# EAGLE schematic Sensor_ESP32_1.0 (EAGLE 9.6.2)
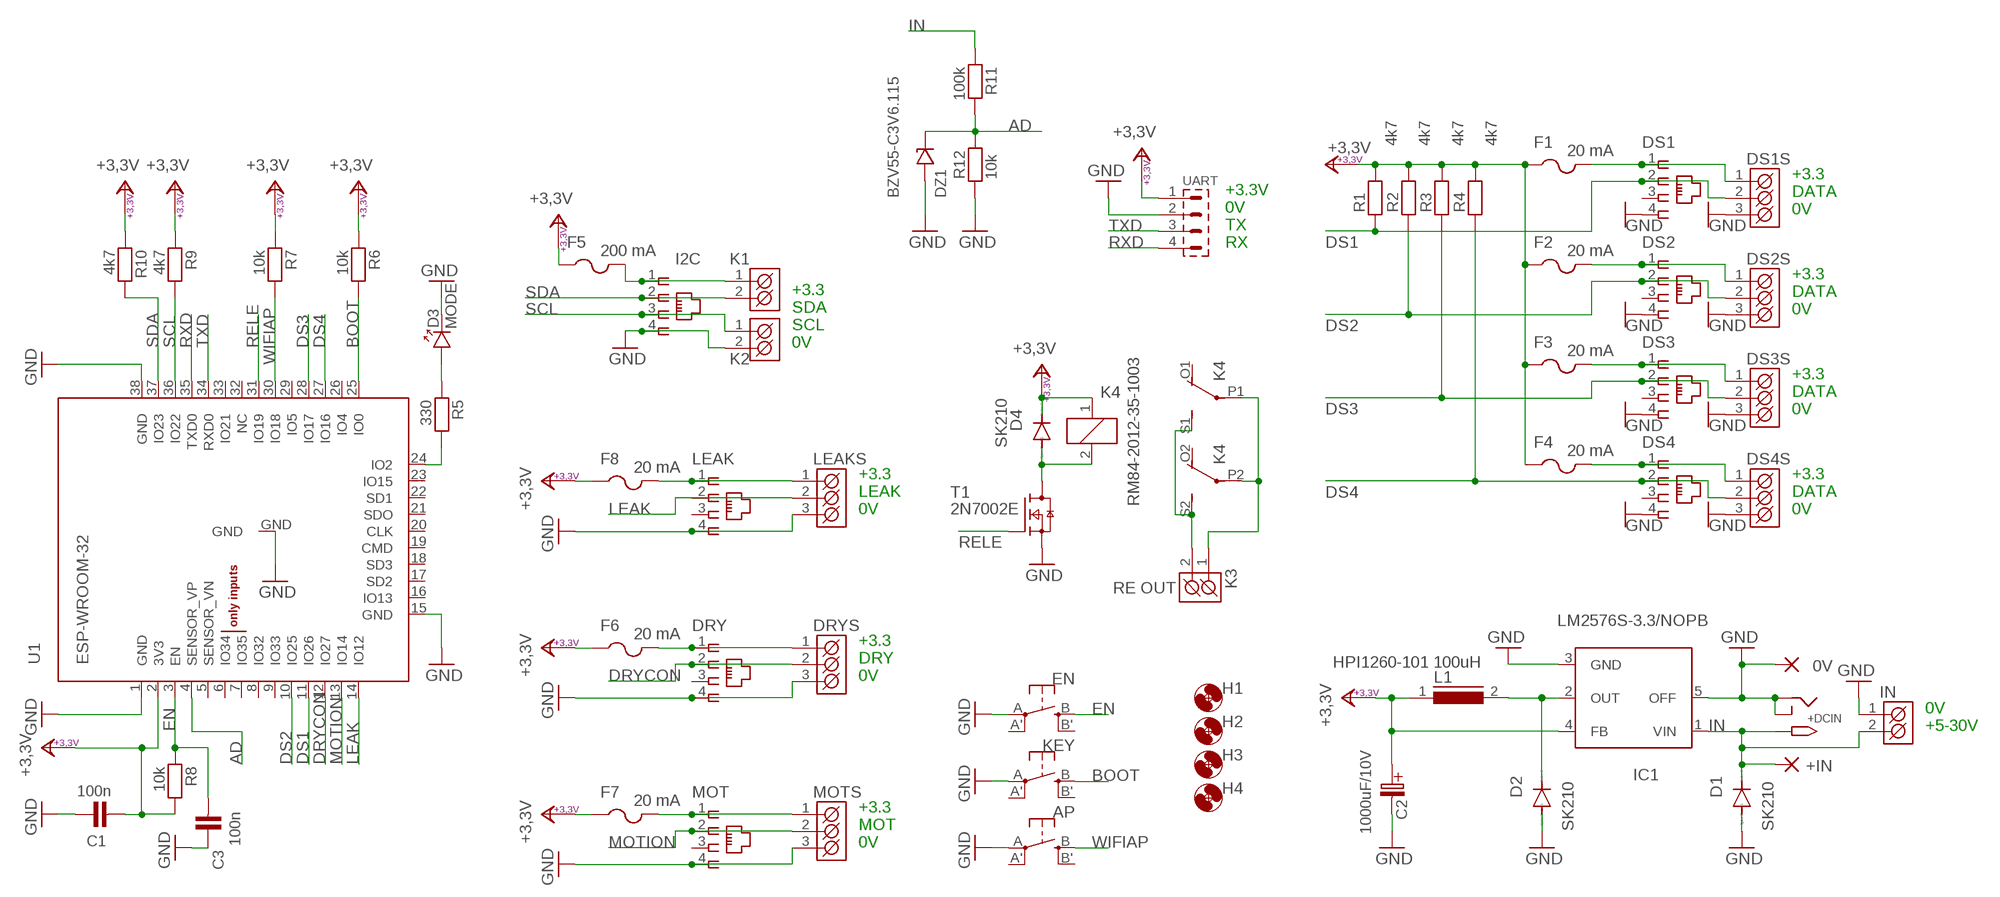
[diagram p0: schematic, sheet 1]

## Parts
0V  SMD2  [SMD1,27-2,54]
+DCIN  2.1MMJACKTHM  [PJ-102A]
+IN  SMD2  [SMD1,27-2,54]
AP  SPST_TACT-EVQQ2  [EVQ-Q2]
C1  100n  C-KER_1206  [1206]
C2  1000uF/10V  C-EL_5  [C-EL_5]
C3  100n  C-KER_1206  [1206]
D1  SK210  DIODE-SMB  [SMB]
D2  SK210  DIODE-SMB  [SMB]
D3  MODE  LED_1206  [P1206]
D4  SK210  DIODE-SMB  [SMB]
DRY  WEBP_6_1  [WEBP_6_1]
DRYS  ARK550/3  [ARK550/3]
DS1  WEBP_6_1  [WEBP_6_1]
DS1S  ARK550/3  [ARK550/3]
DS2  WEBP_6_1  [WEBP_6_1]
DS2S  ARK550/3  [ARK550/3]
DS3  WEBP_6_1  [WEBP_6_1]
DS3S  ARK550/3  [ARK550/3]
DS4  WEBP_6_1  [WEBP_6_1]
DS4S  ARK550/3  [ARK550/3]
DZ1  BZV55-C3V6.115  D-BZV55C_SMD_0,5W-ZENER  [SOD-80]
EN  SPST_TACT-EVQQ2  [EVQ-Q2]
F1  20 mA  PTCFUSE-1206  [R1206]
F2  20 mA  PTCFUSE-1206  [R1206]
F3  20 mA  PTCFUSE-1206  [R1206]
F4  20 mA  PTCFUSE-1206  [R1206]
F5  200 mA  PTCFUSE-1206  [R1206]
F6  20 mA  PTCFUSE-1206  [R1206]
F7  20 mA  PTCFUSE-1206  [R1206]
F8  20 mA  PTCFUSE-1206  [R1206]
H1  MOUNT-HOLE3.0  [3,0]
H2  MOUNT-HOLE3.0  [3,0]
H3  MOUNT-HOLE3.0  [3,0]
H4  MOUNT-HOLE3.0  [3,0]
I2C  WEBP_6_1  [WEBP_6_1]
IC1  LM2576S-3.3/NOPB  LM2576S  [TO263-5]
IN  ARK550/2  [ARK550/2]
K1  ARK550/2  [ARK550/2]
K2  ARK550/2  [ARK550/2]
K3  RE OUT  ARK500/2  [ARK500/2]
K4  RM84-2012-35-1003  G2R2  [G2R2]
KEY  SPST_TACT-EVQQ2  [EVQ-Q2]
L1  HPI1260-101 100uH  DR125  [DR125]
LEAK  WEBP_6_1  [WEBP_6_1]
LEAKS  ARK550/3  [ARK550/3]
MOT  WEBP_6_1  [WEBP_6_1]
MOTS  ARK550/3  [ARK550/3]
R1  4k7  R_1206  [1206]
R2  4k7  R_1206  [1206]
R3  4k7  R_1206  [1206]
R4  4k7  R_1206  [1206]
R5  330  R_1206  [1206]
R6  10k  R_1206  [1206]
R7  10k  R_1206  [1206]
R8  10k  R_1206  [1206]
R9  4k7  R_1206  [1206]
R10  4k7  R_1206  [1206]
R11  100k  R_1206  [1206]
R12  10k  R_1206  [1206]
T1  2N7002E  [SOT23]
U1  ESP-WROOM-32  [ESP-WROOM-32]
UART  S1G4_JUMP  [S1G4_JUM]

## Nets
+3,3V: C1.2 C2.C+(C_EL+) D4.C F1.1 F2.1 F3.1 F4.1 F5.1 F6.1 F7.1 F8.1 IC1.4(FB) K4.1 L1.1 R1.2 R2.2 R3.2 R4.2 R6.1 R7.1 R8.2 R9.1 R10.1 U1.2(3V3) UART.1
AD: DZ1.K R11.2 R12.2 U1.4(SENSOR_VP)
BOOT: KEY.B(S) R6.2 U1.25(IO0)
DRYCON: DRY.2 DRYS.2(K2) U1.12(IO27)
DS1: DS1.2 DS1S.2(K2) R1.1 U1.11(IO26)
DS2: DS2.2 DS2S.2(K2) R2.1 U1.10(IO25)
DS3: DS3.2 DS3S.2(K2) R3.1 U1.28(IO17)
DS4: DS4.2 DS4S.2(K2) R4.1 U1.27(IO16)
EN: C3.2 EN.B(S) R8.1 U1.3(EN)
GND: 0V.1(P) +DCIN.RING +DCIN.RING_SW AP.A(P) C1.1 C2.C-(C_EL-) C3.1 D1.A D2.A D3.K DRY.4 DRYS.3(K3) DS1.4 DS1S.3(K3) DS2.4 DS2S.3(K3) DS3.4 DS3S.3(K3) DS4.4 DS4S.3(K3) DZ1.A EN.A(P) I2C.4 IC1.3(GND) IC1.5(OFF) IN.1(K1) K2.2(K2) KEY.A(P) LEAK.4 LEAKS.3(K3) MOT.4 MOTS.3(K3) R12.1 T1.2(S) U1.1(GND) U1.15(GND) U1.38(GND) U1.GND UART.2
IN: +DCIN.TIP +IN.1(P) D1.C IC1.1(VIN) IN.2(K2) R11.1
LEAK: LEAK.2 LEAKS.2(K2) U1.14(IO12)
MOTION: MOT.2 MOTS.2(K2) U1.13(IO14)
N$1: DS1.1 DS1S.1(K1) F1.2
N$2: D2.C IC1.2(OUT) L1.2
N$3: DS2.1 DS2S.1(K1) F2.2
N$4: F8.2 LEAK.1 LEAKS.1(K1)
N$5: DS3.1 DS3S.1(K1) F3.2
N$6: DS4.1 DS4S.1(K1) F4.2
N$7: F5.2 I2C.1 K1.1(K1)
N$8: D4.A K4.2 T1.3(D)
N$9: R5.2 U1.24(IO2)
N$10: K3.2(K2) K4.S1(2:S) K4.S2(3:S)
N$11: K3.1(K1) K4.P1(2:P) K4.P2(3:P)
N$12: DRY.1 DRYS.1(K1) F6.2
N$13: F7.2 MOT.1 MOTS.1(K1)
N$18: D3.A R5.1
RELE: T1.1(G) U1.31(IO19)
RXD: U1.35(TXD0) UART.4
SCL: I2C.3 K2.1(K1) R9.2 U1.36(IO22)
SDA: I2C.2 K1.2(K2) R10.2 U1.37(IO23)
TXD: U1.34(RXD0) UART.3
WIFIAP: AP.B(S) R7.2 U1.30(IO18)
Unconnected: AP.A'(P1) AP.B'(S1) DRY.3 DS1.3 DS2.3 DS3.3 DS4.3 EN.A'(P1) EN.B'(S1) K4.O1(2:O) K4.O2(3:O) KEY.A'(P1) KEY.B'(S1) LEAK.3 MOT.3 U1.5(SENSOR_VN) U1.6(IO34) U1.7(IO35) U1.8(IO32) U1.9(IO33) U1.16(IO13) U1.17(SD2) U1.18(SD3) U1.19(CMD) U1.20(CLK) U1.21(SDO) U1.22(SD1) U1.23(IO15) U1.26(IO4) U1.29(IO5) U1.32(NC) U1.33(IO21)

## Notes on the sheet
- +3.3
  DATA
  0V
- +3.3V
  0V
  TX
  RX
- +3.3
  DATA
  0V
- +3.3
  SDA
  SCL
  0V
- +3.3
  DATA
  0V
- +3.3
  LEAK
  0V
- +3.3
  DATA
  0V
- +3.3
  DRY
  0V
- 0V
  +5-30V
- +3.3
  MOT
  0V

## Library data of the parts
0V +IN = wirepad:SMD2: SMD PAD
+DCIN = adafruit:2.1MMJACK: 2.1mm x 5.5mm THM DC jack with internal switch. Digikey part #PJ-102A, 4UCON part #05537 2.1mm x 5.5mm SMT DC jack with internal switch. Digikey part #PJ-002A-SMT, 4UCON part #03267 By microbuilder.eu & adafruit.com
AP EN KEY = adafruit:SPST_TACT: SMT 6mm switch, EVQQ2 series http://www.ladyada.net/library/eagle
C1 C3 = #PaJa_31:C-KER: Kondenzator - keramicky
C2 = #PaJa_31:C-EL: Kondenzator - elektrolyticky
D1 D2 D4 = diode:DIODE-: DIODE
D3 = #PaJa_31:LED: LED - jednobarevna
DRY DS1-DS4 I2C LEAK MOT = #PaJa_konektory:WEBP_6_1
DRYS DS1S DS2S DS3S DS4S LEAKS MOTS = #PaJa_konektory:ARK550/3: Svorkovnice - roztec 3,5mm - trojita
DZ1 = #PaJa_31:D-?-ZENER: Zenerova dioda
F1-F8 = adafruit:PTCFUSE: PTC fuses, resettable thermistors
H1-H4 = holes:MOUNT-HOLE: MOUNTING HOLE with drill center marker
IC1 = v-reg-3:LM2576: National Semiconductor <http://www.national.com> 3.0A "Simple Switcher"(c) 52kHz, Vout 1.23-37V (HV: 57V), Vin 40V (HV: 60V), 50µA standby current
IN K1 K2 = #PaJa_konektory:ARK550/2: Svorkovnice - roztec 3,5mm - dvojita
K3 = #PaJa_konektory:ARK500/2: Svorkovnice - roztec 5mm - dvojita
K4 = relay:G2R2: RELAY 2 x switch, Omron; MF: OMRON COMPONENTS USA; MPN: G2R-2-DC6; OC_FARNELL: unknown; OC_NEWARK: 89C5317
L1 = inductors:DR125: High Power Density, High Efficiency, Shielded Inductors Source: coiltronics_dr_series.pdf; SPICEPREFIX: L
R1-R12 = #PaJa_31:R: Rezistor
T1 = nxp_60:2N7002: N-channel TrenchMOS FET N-channel enhancement mode Field-Effect Transistor (FET) in a plastic package using TrenchMOS technology. AAL Eindhoven MK
U1 = esp32:ESP-WROOM-32
UART = #PaJa_konektory:S1G4_JUMP: Radove konektory - koliky - 4x